# EAGLE design MB_Digital_and_Aanalog (EAGLE 9.5.0)
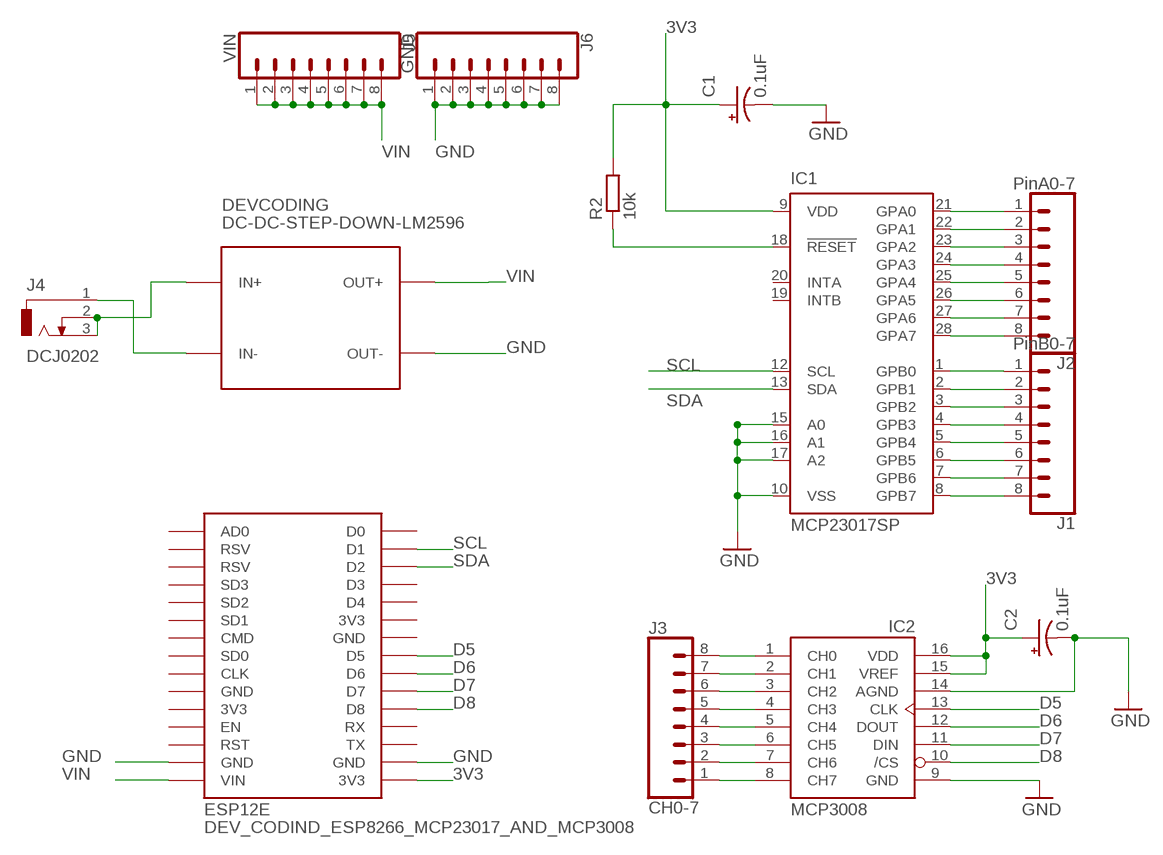
[diagram p0: schematic, sheet 1]

## Parts
C1  0.1uF  CPOL-USE1.8-4  [E1,8-4]
C2  0.1uF  CPOL-USE1.8-4  [E1,8-4]
DEV_CODIND_ESP8266_MCP23017_AND_MCP3008  ESP12E  ESP12E_DEVKIT  [ESP12E_DEVKIT]
DEVCODING  DC-DC-STEP-DOWN-LM2596  [DC-DC-STEP-DOWN-LM2596]
IC1  MCP23017SP  [DIL28-3]
IC2  MCP3008  [DIL16]
J1  PinB0-7  CONN_08LONGPADS  [1X08_LONGPADS]
J2  PinA0-7  CONN_08LONGPADS  [1X08_LONGPADS]
J3  CH0-7  CONN_08LONGPADS  [1X08_LONGPADS]
J4  DCJ0202  [DCJ0202]
J5  VIN  CONN_08LONGPADS  [1X08_LONGPADS]
J6  GND  CONN_08LONGPADS  [1X08_LONGPADS]
R2  10k  R-EU_0207/7  [0207/7]

## Nets
3V3: C1.+ C2.+ DEV_CODIND_ESP8266_MCP23017_AND_MCP3008.3V3@2(3V3) IC1.9(VDD) IC2.15(VREF) IC2.16(VDD) R2.2
D5: DEV_CODIND_ESP8266_MCP23017_AND_MCP3008.D5 IC2.13(CLK)
D6: DEV_CODIND_ESP8266_MCP23017_AND_MCP3008.D6 IC2.12(DOUT)
D7: DEV_CODIND_ESP8266_MCP23017_AND_MCP3008.D7 IC2.11(DIN)
D8: DEV_CODIND_ESP8266_MCP23017_AND_MCP3008.D8 IC2.10(/CS)
GND: C1.- C2.- DEV_CODIND_ESP8266_MCP23017_AND_MCP3008.GND@1(GND) DEV_CODIND_ESP8266_MCP23017_AND_MCP3008.GND@3(GND) DEVCODING.OUT- IC1.10(VSS) IC1.15(A0) IC1.16(A1) IC1.17(A2) IC2.9(GND) IC2.14(AGND) J6.1 J6.2 J6.3 J6.4 J6.5 J6.6 J6.7 J6.8
N$1: IC1.21(GPA0) J2.1
N$2: IC1.22(GPA1) J2.2
N$3: IC1.23(GPA2) J2.3
N$4: IC1.18(!RESET) R2.1
N$5: IC1.24(GPA3) J2.4
N$6: IC1.25(GPA4) J2.5
N$7: IC1.26(GPA5) J2.6
N$8: IC1.27(GPA6) J2.7
N$9: IC1.28(GPA7) J2.8
N$10: IC1.1(GPB0) J1.1
N$11: IC1.2(GPB1) J1.2
N$12: IC1.3(GPB2) J1.3
N$13: IC1.4(GPB3) J1.4
N$14: IC1.5(GPB4) J1.5
N$15: IC1.6(GPB5) J1.6
N$16: IC1.7(GPB6) J1.7
N$17: IC1.8(GPB7) J1.8
N$18: IC2.1(CH0) J3.8
N$19: IC2.2(CH1) J3.7
N$20: IC2.3(CH2) J3.6
N$21: IC2.4(CH3) J3.5
N$22: IC2.5(CH4) J3.4
N$23: IC2.6(CH5) J3.3
N$24: IC2.7(CH6) J3.2
N$25: IC2.8(CH7) J3.1
N$28: DEVCODING.IN- J4.1
N$29: DEVCODING.IN+ J4.2 J4.3
SCL: DEV_CODIND_ESP8266_MCP23017_AND_MCP3008.D1 IC1.12(SCL)
SDA: DEV_CODIND_ESP8266_MCP23017_AND_MCP3008.D2 IC1.13(SDA)
VIN: DEV_CODIND_ESP8266_MCP23017_AND_MCP3008.VIN DEVCODING.OUT+ J5.1 J5.2 J5.3 J5.4 J5.5 J5.6 J5.7 J5.8
Unconnected: DEV_CODIND_ESP8266_MCP23017_AND_MCP3008.3V3@0(3V3) DEV_CODIND_ESP8266_MCP23017_AND_MCP3008.3V3@1(3V3) DEV_CODIND_ESP8266_MCP23017_AND_MCP3008.AD0 DEV_CODIND_ESP8266_MCP23017_AND_MCP3008.CLK DEV_CODIND_ESP8266_MCP23017_AND_MCP3008.CMD DEV_CODIND_ESP8266_MCP23017_AND_MCP3008.D0 DEV_CODIND_ESP8266_MCP23017_AND_MCP3008.D3 DEV_CODIND_ESP8266_MCP23017_AND_MCP3008.D4 DEV_CODIND_ESP8266_MCP23017_AND_MCP3008.EN DEV_CODIND_ESP8266_MCP23017_AND_MCP3008.GND@0(GND) DEV_CODIND_ESP8266_MCP23017_AND_MCP3008.GND@2(GND) DEV_CODIND_ESP8266_MCP23017_AND_MCP3008.RST DEV_CODIND_ESP8266_MCP23017_AND_MCP3008.RSV@0(RSV) DEV_CODIND_ESP8266_MCP23017_AND_MCP3008.RSV@1(RSV) DEV_CODIND_ESP8266_MCP23017_AND_MCP3008.RX DEV_CODIND_ESP8266_MCP23017_AND_MCP3008.SD0 DEV_CODIND_ESP8266_MCP23017_AND_MCP3008.SD1 DEV_CODIND_ESP8266_MCP23017_AND_MCP3008.SD2 DEV_CODIND_ESP8266_MCP23017_AND_MCP3008.SD3 DEV_CODIND_ESP8266_MCP23017_AND_MCP3008.TX IC1.19(INTB) IC1.20(INTA)

## Library data of the parts
C1 C2 = adafruit:CPOL-US: POLARIZED CAPACITOR, American symbol
DEV_CODIND_ESP8266_MCP23017_AND_MCP3008 = ESP12E_DEVKIT:ESP12E_DEVKIT: ESP12E DEVKIT BOARD
DEVCODING = diy-modules:DC-DC-STEP-DOWN-LM2596: DC/DC Step-Down Regulator based on LM2596-ADJ chip LM2596 datasheet available here: http://www.ti.com/lit/ds/symlink/lm2596.pdf Click here to find device on ebay.com <http://www.ebay.com/sch/lm2596+power+regulator>
IC1 = adafruit:MCP23017: http://ww1.microchip.com/downloads/en/DeviceDoc/21952a.pdf Source: http://ww1.microchip.com/downloads/en/DeviceDoc/21952a.pdf
IC2 = adafruit:MCP3008
J1-J3 J5 J6 = SparkFun-Connectors:CONN_08: Multi connection point. Often used as Generic Header-pin footprint for 0.1 inch spaced/style header connections On any of the 0.1 inch spaced packages, you can populate with these: Break Away Headers - Straight <https://www.sparkfun.com/products/116> (PRT-00116) Break Away Male Headers - Right Angle <https://www.sparkfun.com/products/553> (PRT-00553) Female Headers <https://www.sparkfun.com/products/115> (PRT-00115) Break Away Headers - Machine Pin <https://www.sparkfun.com/products/117> (PRT-00117) Break Away Female Headers - Swiss Machine Pin <https://www.sparkfun.com/products/743> (PRT-00743) Arduino Stackable Header - 8 Pin <https://www.sparkfun.com/products/9279> (PRT-09279) For SCREWTERMINALS and SPRING TERMINALS visit here: Screw Terimnals on SparkFun.com <https://www.sparkfun.com/search/results?term=Screw+Terminals> (5mm/3.5mm/2.54mm spacing) This device is also useful as a general connection point to wire up your design to another part of your project. Our various solder wires solder well into these plated through hole pads. Hook-Up Wire - Assortment (Stranded, 22 AWG) <https://www.sparkfun.com/products/11375> (PRT-11375) Hook-Up Wire - Assortment (Solid Core, 22 AWG) <https://www.sparkfun.com/products/11367> (PRT-11367) View the entire wire category on our website here <https://www.sparkfun.com/categories/141> Special notes: Molex polarized connector foot print use with SKU : PRT-08231 with associated crimp pins and housings. 1MM SMD Version SKU: PRT-10208 NOTES ON THE VARIANTS LOCK and LOCK_LONGPADS... This footprint was designed to help hold the alignment of a through-hole component (i.e. 6-pin header) while soldering it into place. You may notice that each hole has been shifted either up or down by 0.005 of an inch from it's more standard position (which is a perfectly straight line). This slight alteration caused the pins (the squares in the middle) to touch the edges of the holes. Because they are alternating, it causes a "brace" to hold the component in place. 0.005 has proven to be the perfect amount of "off-center" position when using our standard breakaway headers. Although looks a little odd when you look at the bare footprint, once you have a header in there, the alteration is very hard to notice. Also,if you push a header all the way into place, it is covered up entirely on the bottom side.
J4 = con-jack:DCJ0202: DC POWER JACK Source: DCJ0202.pdf; OC_FARNELL: unknown; OC_NEWARK: unknown
R2 = resistor:R-EU_: RESISTOR, European symbol

## Board
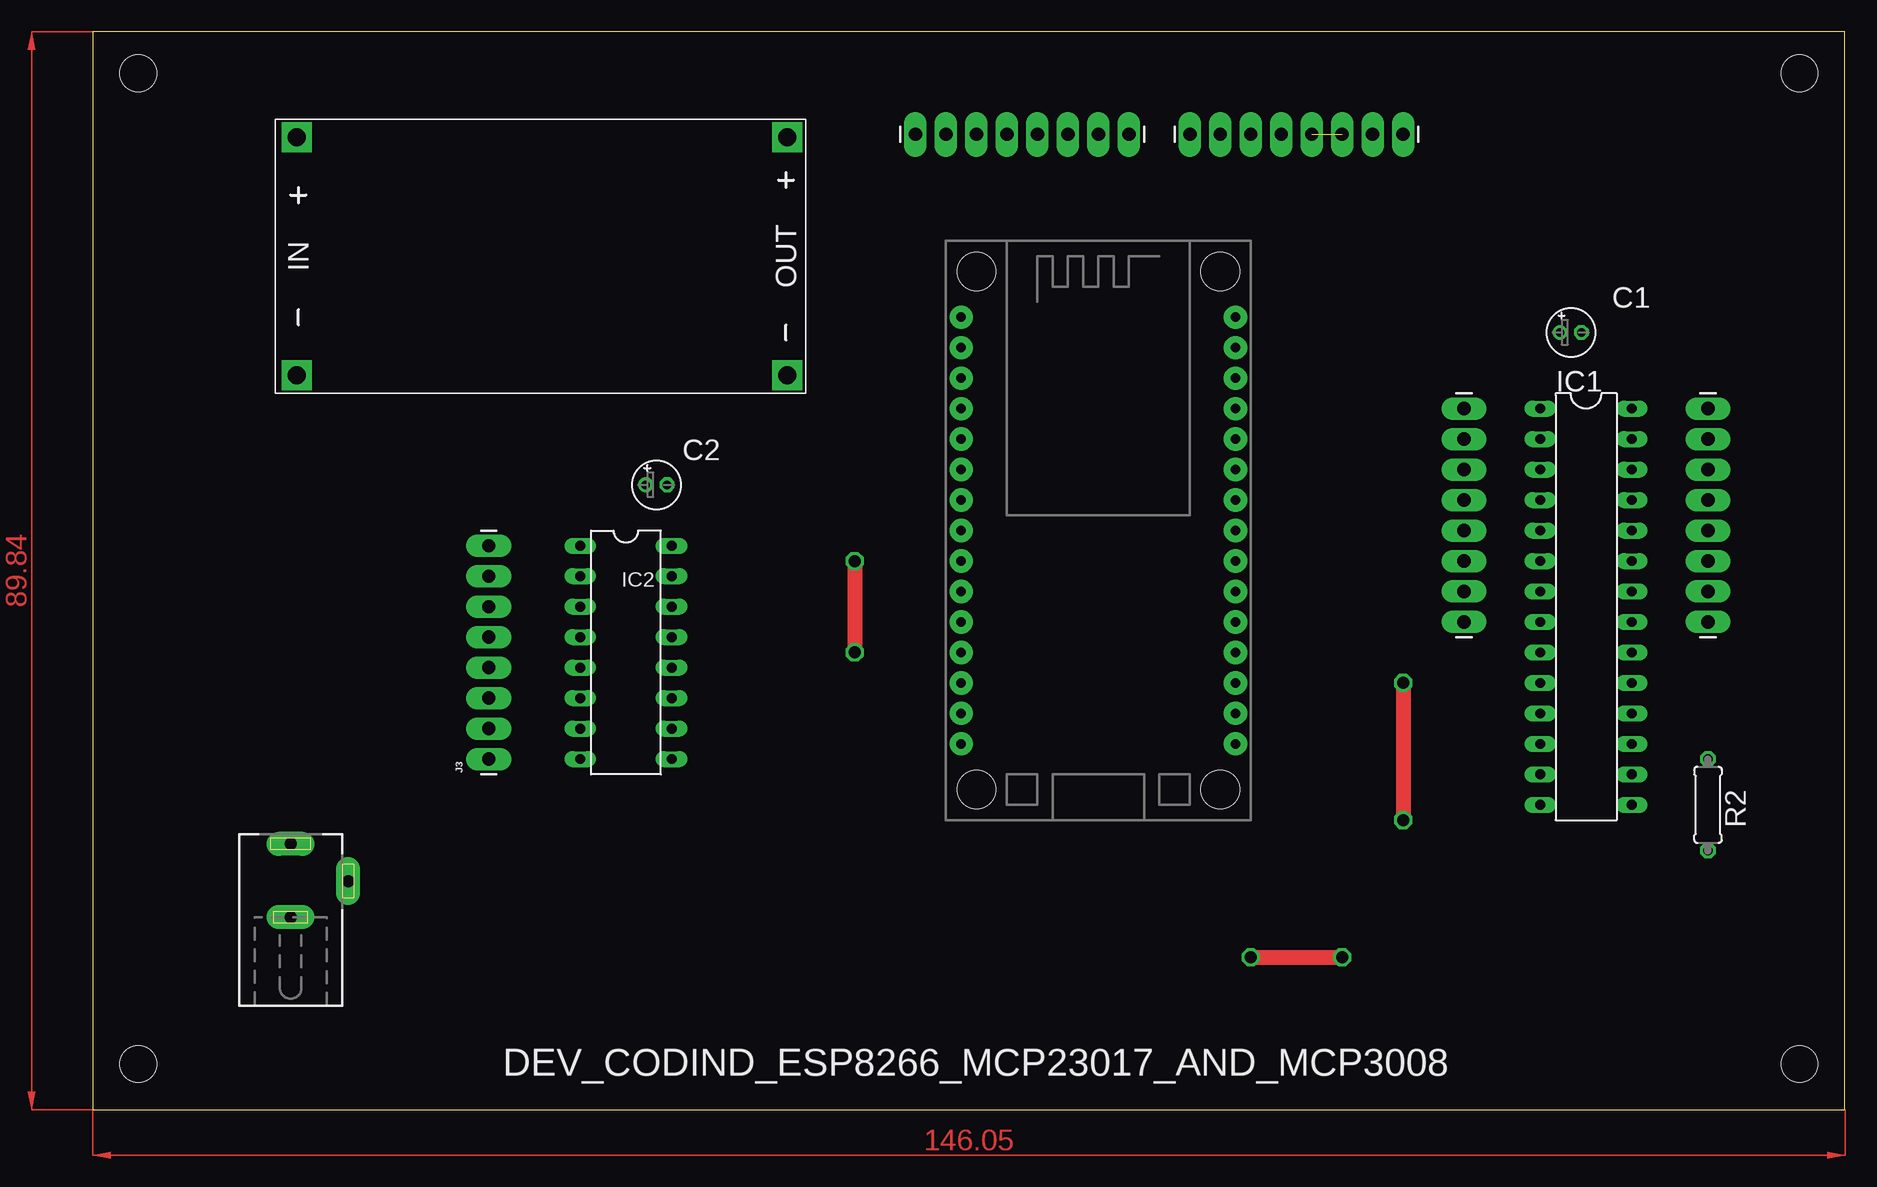
[diagram p1: board, top side]
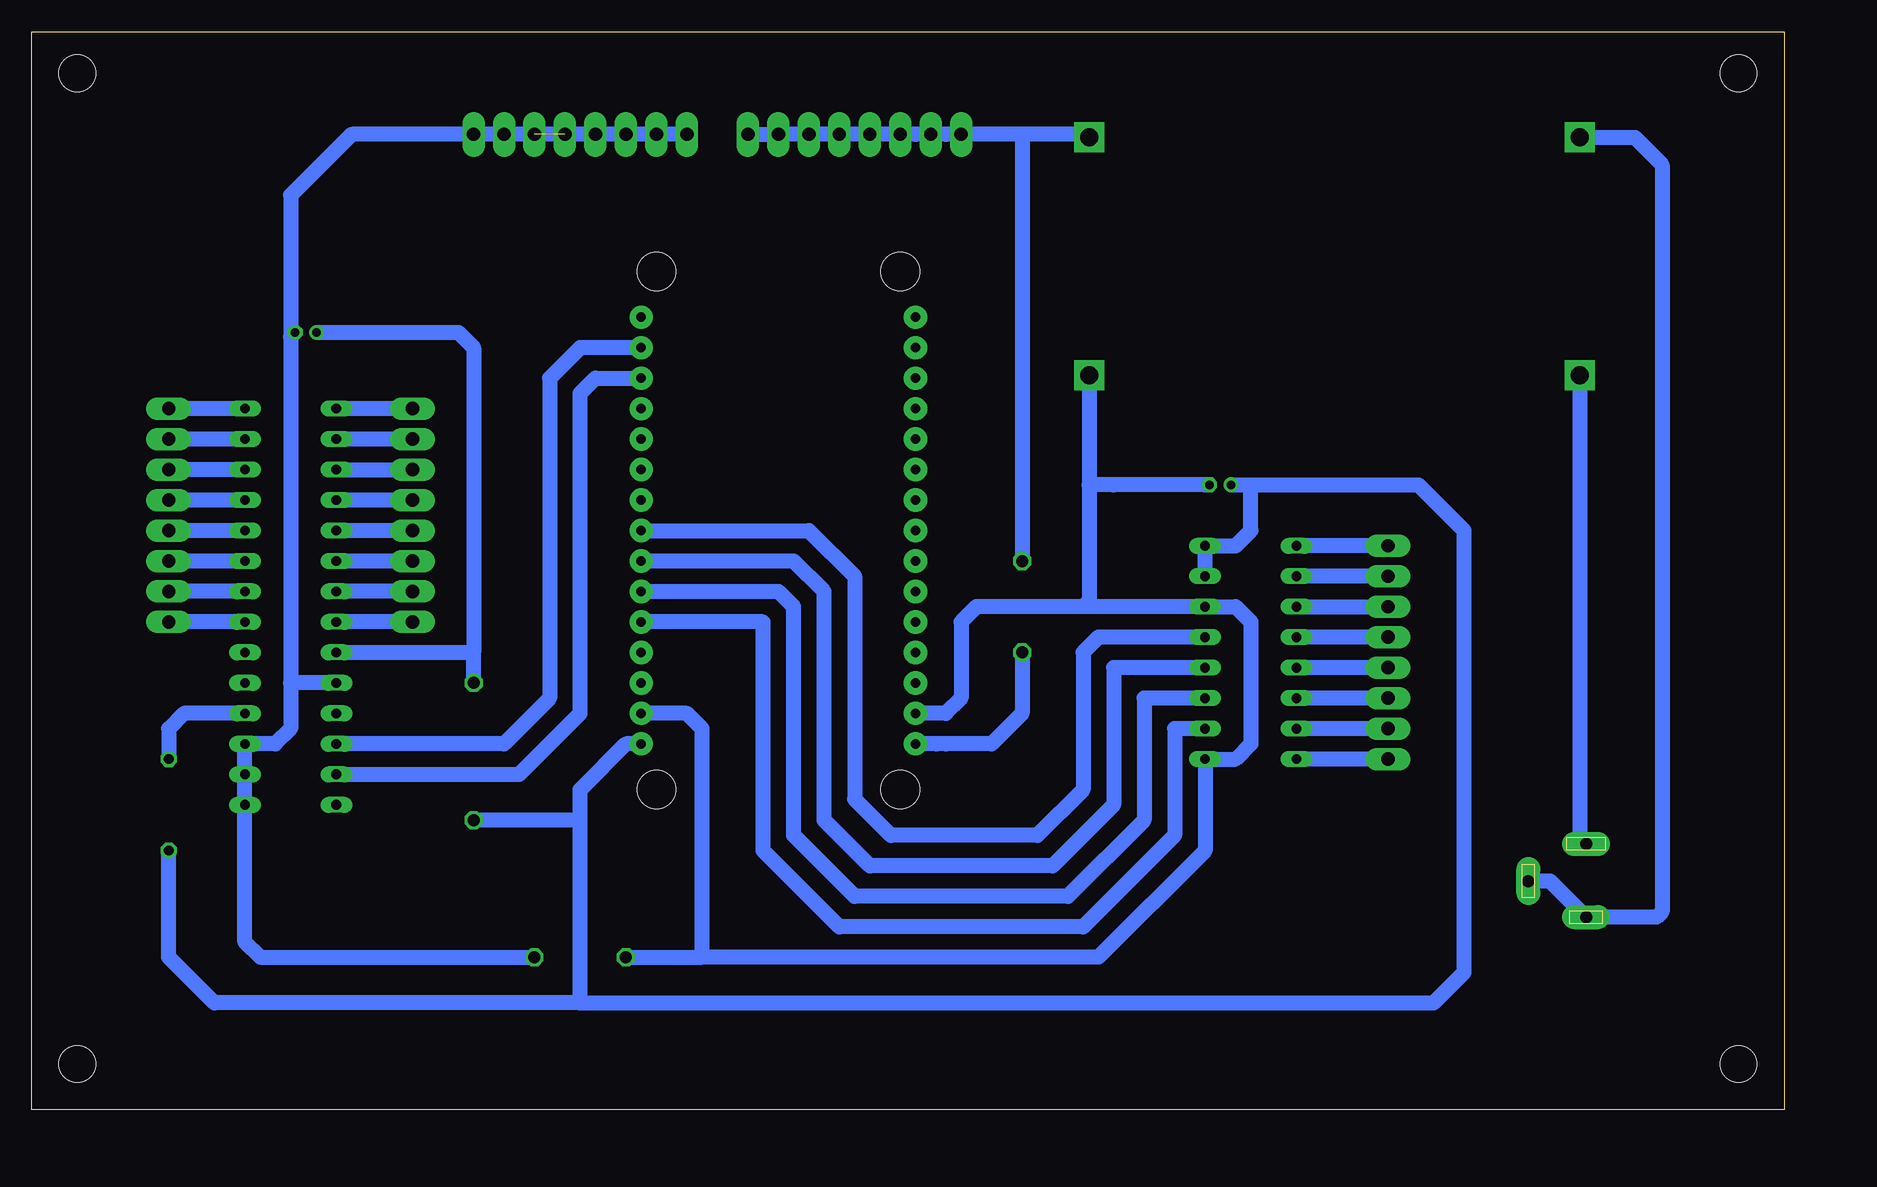
[diagram p2: board, bottom side, seen from below]

Size 146.03 x 89.84 mm. Coordinates in mm from the lower left corner, seen from the top.
Outline: 0,0 146.03,0 146.03,89.84 0,89.84 0,0
Copper layers (1*16): Top 0.035mm / dielectric 1.5mm / Bottom 0.035mm
Design rules "default": minimum track width 6mil, minimum drill 0.35mm, track to track 6mil, track to pad 6mil, pad to pad 6mil, via to via 6mil, smd to smd 6mil, copper to edge 40mil, drill to drill 6mil, minimum pad ring 10mil, minimum via ring 8mil, stop-mask expansion 4mil, vias tented up to drill 0mil, thermal gap 10mil
Holes 3.05 mm at 3.81,86.36 3.81,3.81 142.24,3.81 142.24,86.36

### Footprints (pad centres in the part's own frame; a part is rotated, then mirrored left to right if it is on the bottom)
E1,8-4 = drill 0.711 pad 1.168: + -0.889,0 | drill 0.711 pad 1.168 octagon: - 0.889,0
ESP12E_DEVKIT = drill 0.8 pad 1.93: 3V3@0 -11.43,-7.62; 3V3@1 11.43,5.08; 3V3@2 11.43,-17.78; AD0 -11.43,17.78; CLK -11.43,-2.54; CMD -11.43,2.54; D0 11.43,17.78; D1 11.43,15.24; D2 11.43,12.7; D3 11.43,10.16; D4 11.43,7.62; D5 11.43,0; D6 11.43,-2.54; D7 11.43,-5.08; D8 11.43,-7.62; EN -11.43,-10.16; GND@0 -11.43,-5.08; GND@1 -11.43,-15.24; GND@2 11.43,2.54; GND@3 11.43,-15.24; RST -11.43,-12.7; RSV@0 -11.43,15.24; RSV@1 -11.43,12.7; RX 11.43,-10.16; SD0 -11.43,0; SD1 -11.43,5.08; SD2 -11.43,7.62; SD3 -11.43,10.16; TX 11.43,-12.7; VIN -11.43,-17.78 | hole 3.2: -10.16,21.59; 10.16,21.59; 10.16,-21.59; -10.16,-21.59
DC-DC-STEP-DOWN-LM2596 = drill 1.5 pad 2.5 square: IN+ -22.352,8.636; IN- -22.352,-11.176; OUT+ 18.542,8.636; OUT- 18.542,-11.176
DIL28-3 = drill 0.813 long: 1 -16.51,-3.81; 2 -13.97,-3.81; 3 -11.43,-3.81; 4 -8.89,-3.81; 5 -6.35,-3.81; 6 -3.81,-3.81; 7 -1.27,-3.81; 8 1.27,-3.81; 9 3.81,-3.81; 10 6.35,-3.81; 11 8.89,-3.81; 12 11.43,-3.81; 13 13.97,-3.81; 14 16.51,-3.81; 15 16.51,3.81; 16 13.97,3.81; 17 11.43,3.81; 18 8.89,3.81; 19 6.35,3.81; 20 3.81,3.81; 21 1.27,3.81; 22 -1.27,3.81; 23 -3.81,3.81; 24 -6.35,3.81; 25 -8.89,3.81; 26 -11.43,3.81; 27 -13.97,3.81; 28 -16.51,3.81
DIL16 = drill 0.813 long: 1 -8.89,-3.81; 2 -6.35,-3.81; 3 -3.81,-3.81; 4 -1.27,-3.81; 5 1.27,-3.81; 6 3.81,-3.81; 7 6.35,-3.81; 8 8.89,-3.81; 9 8.89,3.81; 10 6.35,3.81; 11 3.81,3.81; 12 1.27,3.81; 13 -1.27,3.81; 14 -3.81,3.81; 15 -6.35,3.81; 16 -8.89,3.81
1X08_LONGPADS = drill 1.118 pad 1.88 long: 1 0,0; 2 2.54,0; 3 5.08,0; 4 7.62,0; 5 10.16,0; 6 12.7,0; 7 15.24,0; 8 17.78,0
DCJ0202 = drill 1 pad 2 long: 1 0,3.1; 2 4.8,0; 3 0,-3
0207/7 = drill 0.813 octagon: 1 -3.81,0; 2 3.81,0

### Placement (x,y rotation side)
C1  123.19,64.77 0 top
C2  46.99,52.07 0 top
DEV_CODIND_ESP8266_MCP23017_AND_MCP3008  83.82,48.26 0 top
DEVCODING  39.37,72.39 0 top
IC1  124.46,41.91 270 top
IC2  44.45,38.1 270 top
J1  114.3,58.42 270 top
J2  134.62,40.64 90 top
J3  33.02,29.21 90 top
J4  16.51,19.05 0 top
J5  68.58,81.28 0 top
J6  91.44,81.28 0 top
R2  134.62,25.4 270 top

### Tracks (layer width: path | path; a pad name or v marks a point on that pad's centre or on a via)
3V3  (via drill 1)
  Top 1.27: v109.22,35.56 v109.22,24.13
  Bottom 1.27: IC2.15 IC2.16 45.72,46.99 44.45,48.26 44.45,52.07 C2.+ 30.48,52.07 26.67,48.26 26.67,11.43 29.21,8.89 100.33,8.89 | IC1.9 109.22,38.1 | v109.22,35.56 109.22,38.1 | C1.+ 110.49,64.77 109.22,63.5 109.22,38.1 | 100.33,8.89 130.81,8.89 134.62,12.7 R2.2 | 100.33,8.89 100.33,24.13 | 100.33,24.13 100.33,26.67 96.52,30.48 DEV_CODIND_ESP8266_MCP23017_AND_MCP3008.3V3@2 | 100.33,24.13 v109.22,24.13
D5
  Bottom 1.27: DEV_CODIND_ESP8266_MCP23017_AND_MCP3008.D5 81.28,48.26 77.47,44.45 77.47,25.88 74.45,22.86 62.23,22.86 58.42,26.67 58.42,38.1 57.15,39.37 IC2.13
D6
  Bottom 1.27: IC2.12 55.88,36.83 55.88,25.4 60.96,20.32 76.2,20.32 80.01,24.13 80.01,43.18 82.55,45.72 DEV_CODIND_ESP8266_MCP23017_AND_MCP3008.D6
D7
  Bottom 1.27: DEV_CODIND_ESP8266_MCP23017_AND_MCP3008.D7 83.82,43.18 82.55,41.91 82.55,22.86 77.47,17.78 59.69,17.78 53.34,24.13 53.34,34.29 IC2.11
D8
  Bottom 1.27: IC2.10 50.8,31.75 50.8,22.86 58.42,15.24 78.74,15.24 85.09,21.59 85.09,40.64 DEV_CODIND_ESP8266_MCP23017_AND_MCP3008.D8
GND  (via drill 1)  (1 unrouted)
  Top 1.27: v96.52,12.7 v104.14,12.7
  Bottom 0.152: J6.7 J6.8
  Bottom 1.27: 124.46,35.56 124.46,31.75 125.73,30.48 IC1.17 IC1.16 IC1.15 128.27,13.97 127,12.7 v104.14,12.7 | IC1.10 124.46,35.56 | 48.26,52.07 C2.- 55.88,52.07 57.91,52.07 | C1.- 124.46,64.39 | 124.46,64.39 124.46,35.56 | DEV_CODIND_ESP8266_MCP23017_AND_MCP3008.GND@1 69.85,33.02 68.58,34.29 68.58,40.64 67.31,41.91 58.42,41.91 | 58.42,41.91 55.88,41.91 IC2.14 45.72,41.91 44.45,40.64 44.45,30.48 45.72,29.21 IC2.9 48.26,21.59 57.15,12.7 90.17,12.7 | DEV_CODIND_ESP8266_MCP23017_AND_MCP3008.GND@3 91.44,33.02 90.17,31.75 90.17,12.7 | v96.52,12.7 90.17,12.7 | 124.46,64.39 124.46,76.2 119.38,81.28 J6.8 J6.5 J6.4 J6.3 J6.2 J6.1 | DEVCODING.OUT- 57.91,52.07 | 57.91,52.07 57.91,42.42 58.42,41.91
N$1
  Bottom 1.27: IC1.21 J2.1
N$2
  Bottom 1.27: IC1.22 J2.2
N$3
  Bottom 1.27: IC1.23 J2.3
N$4
  Bottom 1.27: IC1.18 133.35,33.02 134.62,31.75 R2.1
N$5
  Bottom 1.27: IC1.24 J2.4
N$6
  Bottom 1.27: IC1.25 J2.5
N$7
  Bottom 1.27: IC1.26 J2.6
N$8
  Bottom 1.27: IC1.27 J2.7
N$9
  Bottom 1.27: IC1.28 J2.8
N$10
  Bottom 1.27: J1.1 IC1.1
N$11
  Bottom 1.27: J1.2 IC1.2
N$12
  Bottom 1.27: IC1.3 J1.3
N$13
  Bottom 1.27: J1.4 IC1.4
N$14
  Bottom 1.27: J1.5 IC1.5
N$15
  Bottom 1.27: J1.6 IC1.6
N$16
  Bottom 1.27: J1.7 IC1.7
N$17
  Bottom 1.27: J1.8 IC1.8
N$18
  Bottom 1.27: J3.8 IC2.1
N$19
  Bottom 1.27: J3.7 IC2.2
N$20
  Bottom 1.27: IC2.3 J3.6
N$21
  Bottom 1.27: J3.5 IC2.4
N$22
  Bottom 1.27: J3.4 IC2.5
N$23
  Bottom 1.27: J3.3 IC2.6
N$24
  Bottom 1.27: J3.2 IC2.7
N$25
  Bottom 1.27: J3.1 IC2.8
N$28
  Bottom 1.27: DEVCODING.IN- 17.02,22.66 J4.1
N$29
  Bottom 1.27: DEVCODING.IN+ 12.45,81.03 10.16,78.74 10.16,16.51 10.62,16.05 J4.3 19.51,19.05 J4.2
SCL
  Bottom 1.27: DEV_CODIND_ESP8266_MCP23017_AND_MCP3008.D1 100.33,63.5 102.87,60.96 102.87,34.29 106.68,30.48 IC1.12
SDA
  Bottom 1.27: IC1.13 105.41,27.94 100.33,33.02 100.33,59.69 99.06,60.96 DEV_CODIND_ESP8266_MCP23017_AND_MCP3008.D2
VIN  (via drill 1)
  Top 1.27: v63.5,45.72 v63.5,38.1
  Bottom 0.152: 72.39,81.28 J5.3 | J5.1 69.85,81.28
  Bottom 1.27: v63.5,38.1 63.5,33.02 66.04,30.48 69.85,30.48 70.64,30.48 DEV_CODIND_ESP8266_MCP23017_AND_MCP3008.VIN | DEVCODING.OUT+ 57.32,81.28 63.5,81.28 | 63.5,81.28 69.85,81.28 J5.2 | J5.2 72.39,81.28 | 63.5,81.28 v63.5,45.72 | J5.2 J5.3 J5.4 J5.5 J5.6 J5.7 J5.8
(copper drawn outside any net)
  shapes: Top area x2